# Altium schematic sheet RS485.SchDoc
size A3
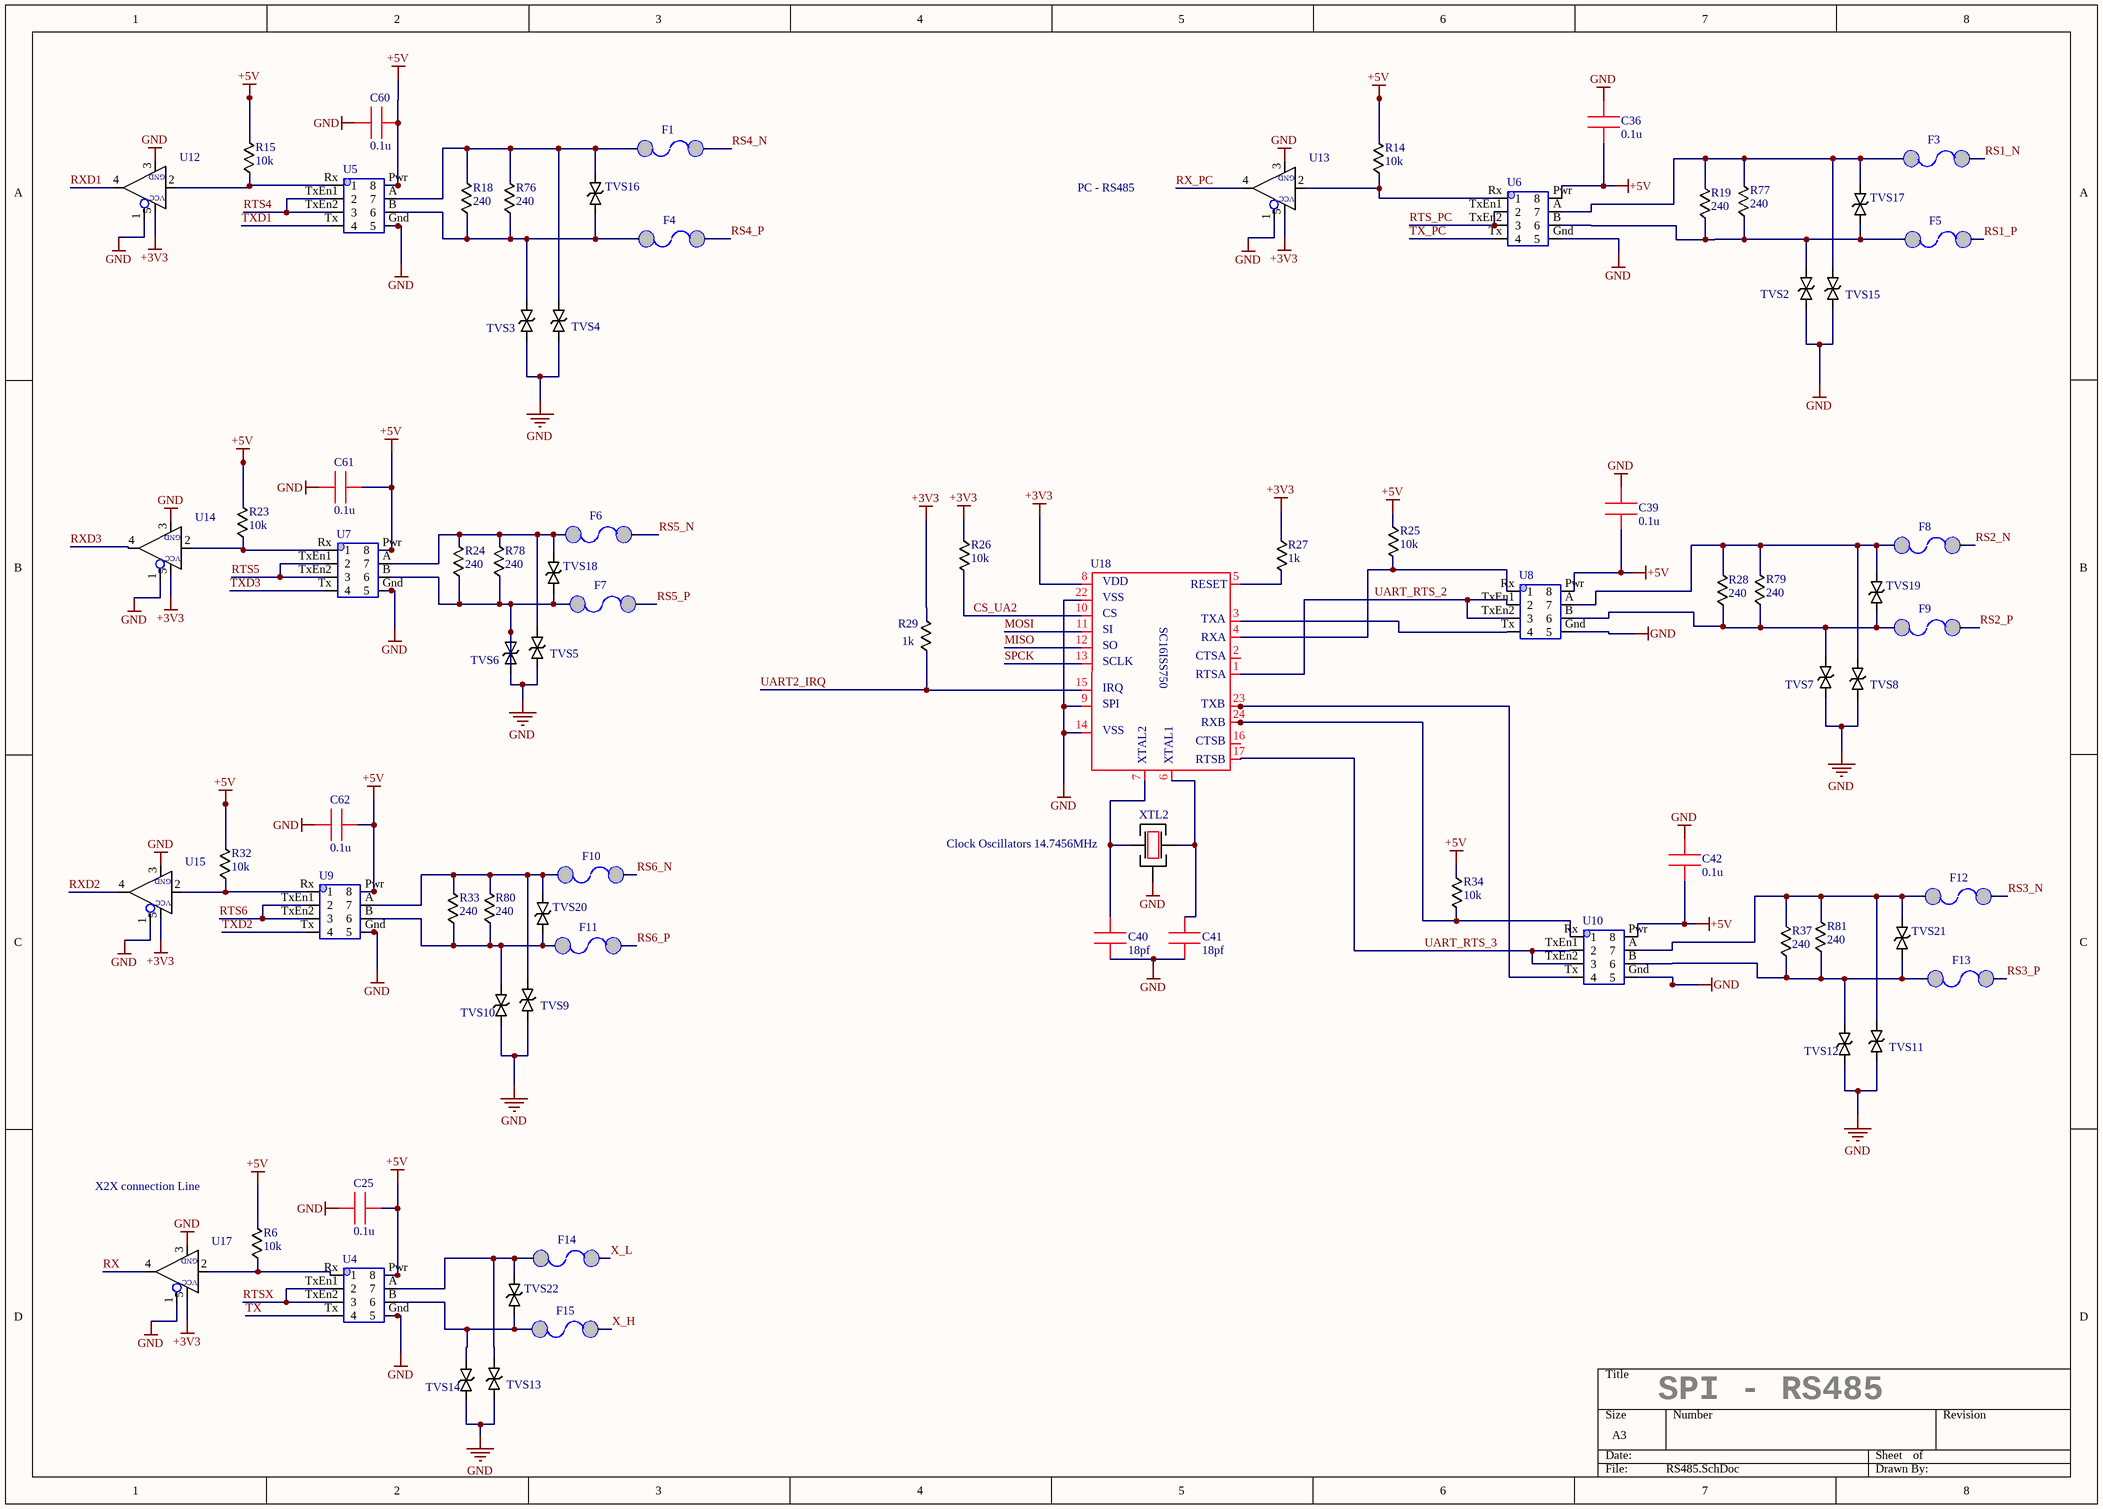
[diagram p0: RS485.SchDoc]

## Parts
C25  0.1u  [0603]
C36  0.1u  [0603]
C39  0.1u  [0603]
C40  18pf  [0603]
C41  18pf  [0603]
C42  0.1u  [0603]
C60  0.1u  [0603]
C61  0.1u  [0603]
C62  0.1u  [0603]
F1  (no value)  [1210]
F3  (no value)  [1210]
F4  (no value)  [1210]
F5  (no value)  [1210]
F6  (no value)  [1210]
F7  (no value)  [1210]
F8  (no value)  [1210]
F9  (no value)  [1210]
F10  (no value)  [1210]
F11  (no value)  [1210]
F12  (no value)  [1210]
F13  (no value)  [1210]
F14  (no value)  [1210]
F15  (no value)  [1210]
R6  10k  [0603]
R14  10k  [0603]
R15  10k  [0603]
R18  240  [0603]
R19  240  [0603]
R23  10k  [0603]
R24  240  [0603]
R25  10k  [0603]
R26  10k  [0603]
R27  1k  [0603]
R28  240  [0603]
R29  1k  [0603]
R32  10k  [0603]
R33  240  [0603]
R34  10k  [0603]
R37  240  [0603]
R76  240  [0603]
R77  240  [0603]
R78  240  [0603]
R79  240  [0603]
R80  240  [0603]
R81  240  [0603]
TVS2  (no value)  [DO-214AC]
TVS3  (no value)  [DO-214AC]
TVS4  (no value)  [DO-214AC]
TVS5  (no value)  [DO-214AC]
TVS6  (no value)  [DO-214AC]
TVS7  (no value)  [DO-214AC]
TVS8  (no value)  [DO-214AC]
TVS9  (no value)  [DO-214AC]
TVS10  (no value)  [DO-214AC]
TVS11  (no value)  [DO-214AC]
TVS12  (no value)  [DO-214AC]
TVS13  (no value)  [DO-214AC]
TVS14  (no value)  [DO-214AC]
TVS15  (no value)  [DO-214AC]
TVS16  (no value)  [DO-214AC]
TVS17  (no value)  [DO-214AC]
TVS18  (no value)  [DO-214AC]
TVS19  (no value)  [DO-214AC]
TVS20  (no value)  [DO-214AC]
TVS21  (no value)  [DO-214AC]
TVS22  (no value)  [DO-214AC]
U4  (no value)  [MAX485 - duplicate]
U5  (no value)  [MAX485 - duplicate]
U6  (no value)  [MAX485 - duplicate]
U7  (no value)  [MAX485 - duplicate]
U8  (no value)  [MAX485 - duplicate]
U9  (no value)  [MAX485 - duplicate]
U10  (no value)  [MAX485 - duplicate]
U12  (no value)  [SOT23 - 5 lead]
U13  (no value)  [SOT23 - 5 lead]
U14  (no value)  [SOT23 - 5 lead]
U15  (no value)  [SOT23 - 5 lead]
U17  (no value)  [SOT23 - 5 lead]
U18  (no value)  [TSSOP28]
XTL2  Part Description: Clock Oscillators 14.7456MHz  [KX-7 XTAL]

## Nets
+3V3: R26.1 R27.1 R29.2 U12.5 U13.5 U14.5 U15.5 U17.5 U18.8
+5V: C25.2 C36.2 C39.2 C42.2 C60.2 C61.2 C62.2 R6.2 R14.2 R15.2 R23.2 R25.1 R32.2 R34.1 U4.Pwr(8) U5.Pwr(8) U6.Pwr(8) U7.Pwr(8) U8.Pwr(8) U9.Pwr(8) U10.Pwr(8)
GND: C25.1 C36.1 C39.1 C40.1 C41.1 C42.1 C60.1 C61.1 C62.1 TVS2.1 TVS3.1 TVS4.1 TVS5.1 TVS6.1 TVS7.1 TVS8.1 TVS9.1 TVS10.1 TVS11.1 TVS12.1 TVS13.1 TVS14.1 TVS15.1 U4.Gnd(5) U5.Gnd(5) U6.Gnd(5) U7.Gnd(5) U8.Gnd(5) U9.Gnd(5) U10.Gnd(5) U12.1 U12.3 U13.1 U13.3 U14.1 U14.3 U15.1 U15.3 U17.1 U17.3 U18.9 U18.14 U18.22 XTL2.2
CS_UA2: R26.2 U18.10
MISO: U18.12
MOSI: U18.11
RS1_N: F3.1
RS1_P: F5.1
RS2_N: F8.1
RS2_P: F9.1
RS3_N: F12.1
RS3_P: F13.1
RS4_N: F1.1
RS4_P: F4.1
RS5_N: F6.1
RS5_P: F7.1
RS6_N: F10.1
RS6_P: F11.1
RTS4: U5.TxEn1(2) U5.TxEn2(3)
RTS5: U7.TxEn1(2) U7.TxEn2(3)
RTS6: U9.TxEn1(2) U9.TxEn2(3)
RTS_PC: U6.TxEn1(2) U6.TxEn2(3)
RTSX: U4.TxEn1(2) U4.TxEn2(3)
RX: U17.4
RX_PC: U13.4
RXD1: U12.4
RXD2: U15.4
RXD3: U14.4
SPCK: U18.13
TX: U4.Tx(4)
TX_PC: U6.Tx(4)
TXD1: U5.Tx(4)
TXD2: U9.Tx(4)
TXD3: U7.Tx(4)
UART2_IRQ: R29.1 U18.15
UART_RTS_2: U8.TxEn1(2) U8.TxEn2(3) U18.1
UART_RTS_3: U10.TxEn1(2) U10.TxEn2(3) U18.17
X_H: F15.1
X_L: F14.1
NetC40_2: C40.2 U18.7 XTL2.1
NetC41_2: C41.2 U18.6 XTL2.3
NetF1_2: F1.2 R18.2 R76.2 TVS4.2 TVS16.2 U5.A(7)
NetF3_2: F3.2 R19.2 R77.2 TVS15.2 TVS17.2 U6.A(7)
NetF4_2: F4.2 R18.1 R76.1 TVS3.2 TVS16.1 U5.B(6)
NetF5_2: F5.2 R19.1 R77.1 TVS2.2 TVS17.1 U6.B(6)
NetF6_2: F6.2 R24.2 R78.2 TVS5.2 TVS18.2 U7.A(7)
NetF7_2: F7.2 R24.1 R78.1 TVS6.2 TVS18.1 U7.B(6)
NetF8_2: F8.2 R28.2 R79.2 TVS8.2 TVS19.2 U8.A(7)
NetF9_2: F9.2 R28.1 R79.1 TVS7.2 TVS19.1 U8.B(6)
NetF10_2: F10.2 R33.2 R80.2 TVS9.2 TVS20.2 U9.A(7)
NetF11_2: F11.2 R33.1 R80.1 TVS10.2 TVS20.1 U9.B(6)
NetF12_2: F12.2 R37.2 R81.2 TVS11.2 TVS21.2 U10.A(7)
NetF13_2: F13.2 R37.1 R81.1 TVS12.2 TVS21.1 U10.B(6)
NetF14_2: F14.2 TVS13.2 TVS22.2 U4.A(7)
NetF15_2: F15.2 TVS14.2 TVS22.1 U4.B(6)
NetR6_1: R6.1 U4.Rx(1) U17.2
NetR14_1: R14.1 U6.Rx(1) U13.2
NetR15_1: R15.1 U5.Rx(1) U12.2
NetR23_1: R23.1 U7.Rx(1) U14.2
NetR25_2: R25.2 U8.Rx(1) U18.4
NetR27_2: R27.2 U18.5
NetR32_1: R32.1 U9.Rx(1) U15.2
NetR34_2: R34.2 U10.Rx(1) U18.24
NetU8_Tx: U8.Tx(4) U18.3
NetU10_Tx: U10.Tx(4) U18.23

Not connected (* = marked no-connect by the designer): U18 2 16

## Notes on the sheet
- PC - RS485
- X2X connection Line
- SPI - RS485
- (in symbol Gate) GND; VCC
- (in symbol SC16IS752) VDD; RESET; VSS; CS; SC16ISS750; TXA; SI; RXA; SO; SCLK; CTSA; RTSA; IRQ; SPI; TXB; RXB; CTSB; XTAL2; XTAL1; RTSB

## Library data of the parts
C25 C36 C39 C42 C60-C62 = Capasitor 0805: Part Description: 0.1 uF 100 VDC 10% 0603 X7R; Part Number: GRM188R72A104KA35D
C40 C41 = Capasitor 0805: Part Description: 18 pF 50 VDC 5% 0603 C0G; Part Number: GRM1885C1H180JA01D
F1 F3-F15 = Fuse PTS: Part Description: PPTC 30V 50MA; Part Number: MF-USMF005-2
R6 R14 R15 R23 R25 R26 R32 R34 = Resistor 0805: Part Description: Resistor 0603, 10kOhms, 5%, 1/10W; Part Number: RC0603JR-0710K
R18 R19 R24 R28 R33 R37 R76-R81 = Resistor 0805: Part Description: Resistor 0603, 240Ohms, 1%, 1/10W; Part Number: RC0603FR-07240RL
R27 R29 = Resistor 0805: Part Description: Resistor 0603, 1kOhms, 5%, 1/10W; Part Number: RC0603JR-071KL
TVS2-TVS15 = SMAJ5.0CA: Part Description: ESD Protection Diodes 5V; Part Number: SMAJ5.0CA
TVS16-TVS22 = TVS: Part Description: ESD Protection Diodes 5V; Part Number: SMAJ5.0CA
U4-U10 = MAX485: Part Description: RS-485 Interface IC Low-Power; Part Number: SN65HVD3082EDR
U12-U15 U17 = Gate: Part Description: SINGLE BUS BUFFER GATE; Part Number: SN74LVC1G125DBVR
U18 = SC16IS752: Part Description: UART Interface IC I2C/SPI; Part Number: SC16IS752IPW,128
XTL2 = KX-7: Part Number: Geyer KX-7 14.7456MHz